# EAGLE design tricorder-featherwing-mk-1.4 (EAGLE 7.5.0)
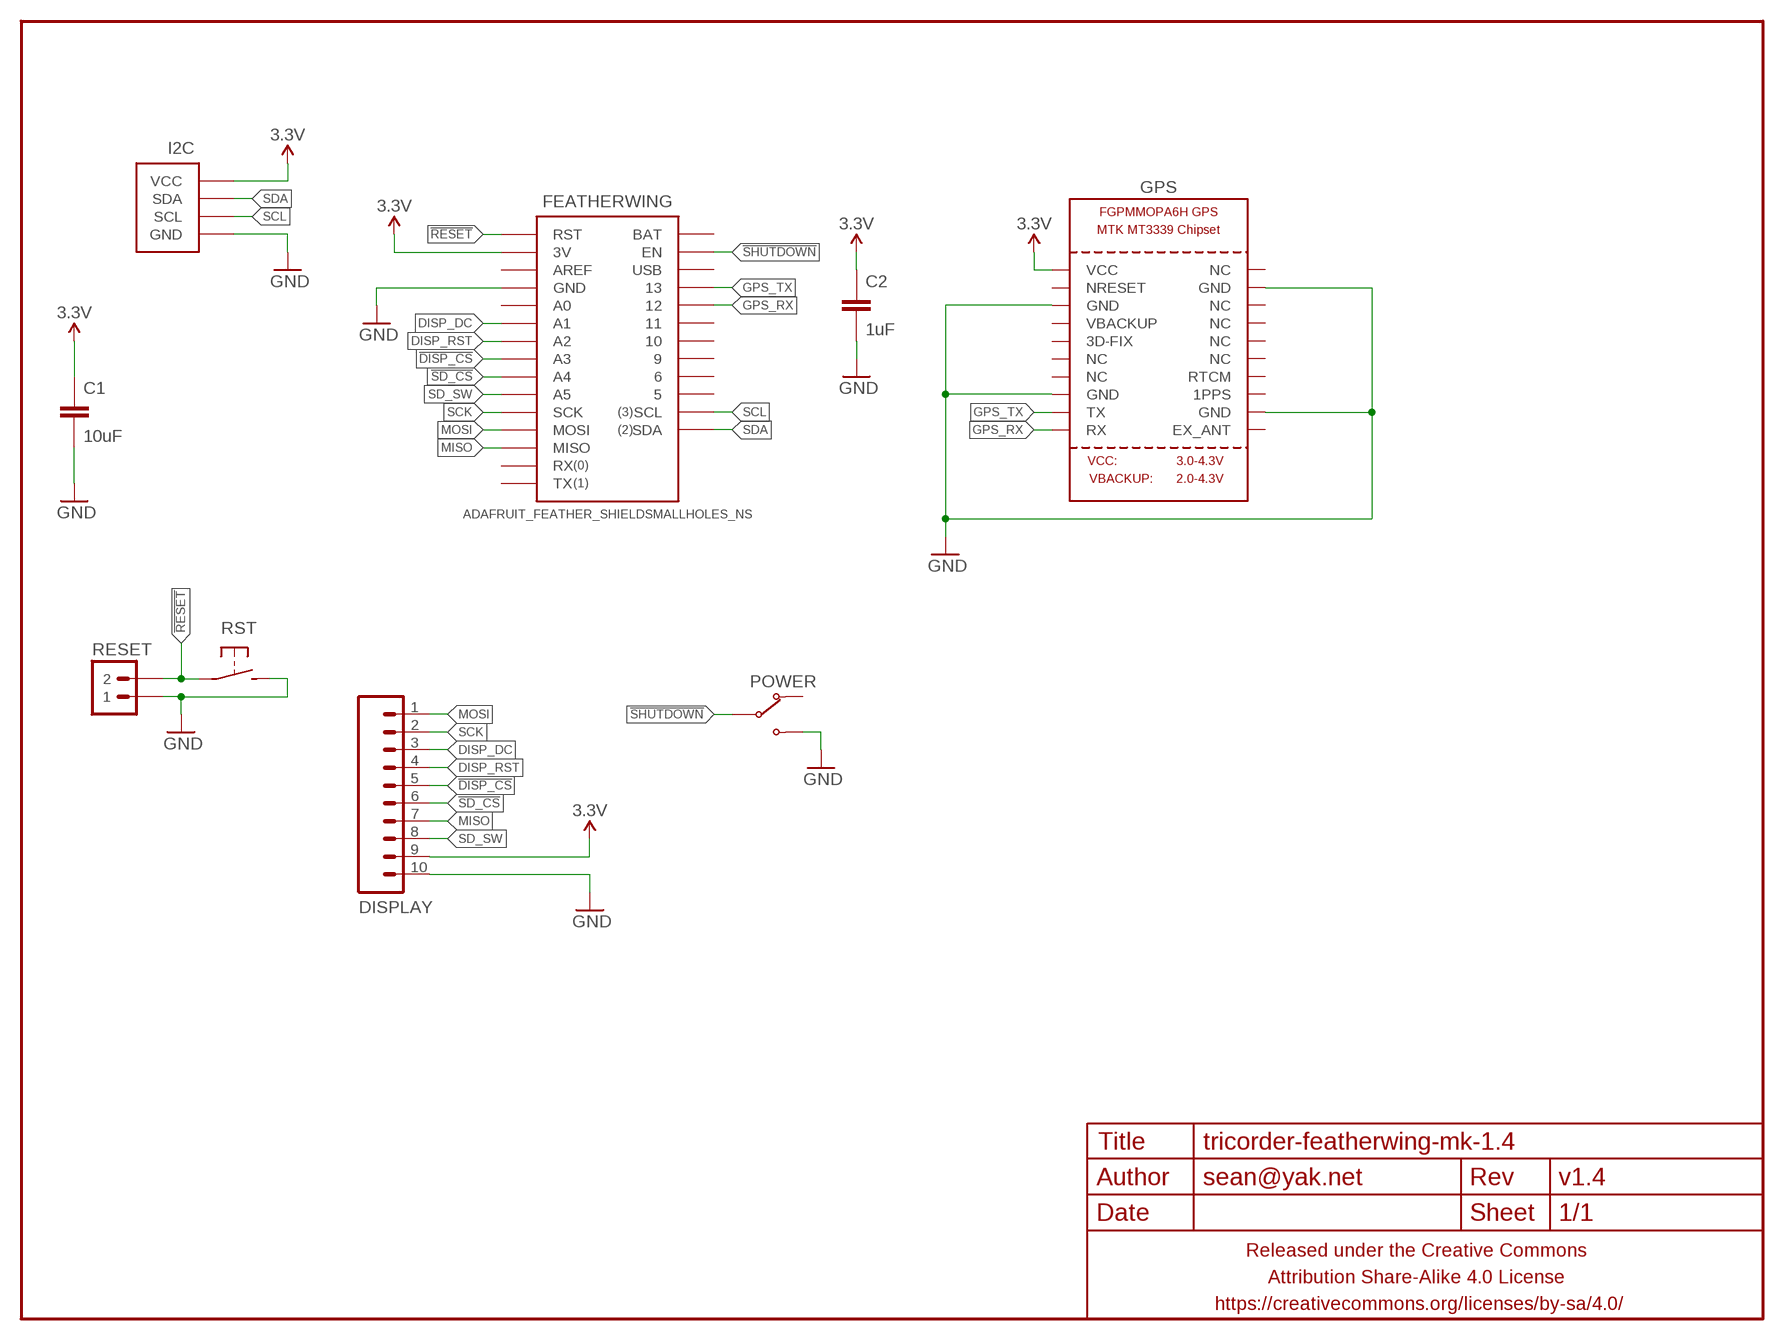
[diagram p0: schematic, sheet 1]

## Parts
C1  10uF  CAPACITOR-CERAMICC1210  [C1210]
C2  1uF  CAPACITOR-CERAMICC0603  [C0603]
DISPLAY  M10JST-10-PH-RA-PTH  [JST-10-PH-RA-PTH]
FEATHERWING  ADAFRUIT_FEATHER_SHIELDSMALLHOLES_NS  [ADAFRUIT_FEATHER_SMALLHOLES_NS]
FRAME1  FRAME-LETTERNO_PACKAGE  [DUMMY]
GPS  GPS_FGPMMOPA6H  [FGPMMOPA6H]
I2C  M04-I2CJST-4-PH-RA-CENTERED  [1X04-JST-PH-RA-PTH-I2C-CENTERED]
POWER  SWITCH-SPDTSMD-RA  [SWITCH-SPDT-SMD-RA]
RESET  M02PTH-CENTERED  [1X02-CENTER]
RST  SPST-NO-TACT3MM-PTH-SMALL-PADS  [DTS-3-SMALL-PADS]

## Nets
3.3V: C1.1 C2.1 DISPLAY.9 FEATHERWING.3V GPS.P$1(VCC) I2C.2(VCC)
!DISP_CS: DISPLAY.5 FEATHERWING.A3
!RESET: FEATHERWING.RST RESET.2 RST.1
!SD_CS: DISPLAY.6 FEATHERWING.A4
!SHUTDOWN: FEATHERWING.EN POWER.2(COM)
DISP_DC: DISPLAY.3 FEATHERWING.A1
DISP_RST: DISPLAY.4 FEATHERWING.A2
GND: C1.2 C2.2 DISPLAY.10 FEATHERWING.GND@0(GND) FEATHERWING.GND@1(GND) GPS.P$3(GND) GPS.P$8(GND) GPS.P$12(GND) GPS.P$19(GND) I2C.1(GND) POWER.1(NO) RESET.1 RST.2
GPS_RX: FEATHERWING.12 GPS.P$10(RX)
GPS_TX: FEATHERWING.13 GPS.P$9(TX)
MISO: DISPLAY.7 FEATHERWING.MISO
MOSI: DISPLAY.1 FEATHERWING.MOSI
SCK: DISPLAY.2 FEATHERWING.SCK
SCL: FEATHERWING.SCL I2C.4(SCL)
SD_SW: DISPLAY.8 FEATHERWING.A5
SDA: FEATHERWING.SDA I2C.3(SDA)
Unconnected: FEATHERWING.5 FEATHERWING.6 FEATHERWING.9 FEATHERWING.10 FEATHERWING.11 FEATHERWING.A0 FEATHERWING.AREF FEATHERWING.BAT FEATHERWING.RX FEATHERWING.TX FEATHERWING.USB GPS.P$2(NRESET) GPS.P$4(VBACKUP) GPS.P$5(3D-FIX) GPS.P$6(NC) GPS.P$7(NC) GPS.P$11(EX_ANT) GPS.P$13(1PPS) GPS.P$14(RTCM) GPS.P$15(NC) GPS.P$16(NC) GPS.P$17(NC) GPS.P$18(NC) GPS.P$20(NC) POWER.3(NC)

## Library data of the parts
C1 C2 = a_parts:CAPACITOR-CERAMIC: CAPACITOR, European symbol
DISPLAY = a_parts:M10: Header 10 Standard 10-pin 0.1" header. Use with straight break away headers (SKU : PRT-00116), right angle break away headers (PRT-00553), swiss pins (PRT-00743), machine pins (PRT-00117), and female headers (PRT-00115).
FEATHERWING = a_parts:ADAFRUIT_FEATHER_SHIELD
FRAME1 = a_parts:FRAME-LETTER: Schematic Frame Standard 8.5x11 US Letter frame; DESIGNER: sean@yak.net; VERSION: v1.4
GPS = a_parts:GPS_FGPMMOPA6H: GPS Module - MTK MT3339 Chipset, -165dBm sensitivity, 22 channels, 10Hz, auto-select external antenna options
I2C = a_parts:M04-I2C
POWER = a_parts:SWITCH-SPDT
RESET = a_parts:M02: Standard 2-pin 0.1" header. Use with - straight break away headers ( PRT-00116) - right angle break away headers (PRT-00553) - swiss pins (PRT-00743) - machine pins (PRT-00117) - female headers (PRT-00115) Molex polarized connector foot print use with: PRT-08233 with associated crimp pins and housings. 2.54_SCREWTERM for use with PRT-10571. 3.5mm Screw Terminal footprints for PRT-08084 5mm Screw Terminal footprints for use with PRT-08433
RST = a_parts:SPST-NO-TACT

## Board
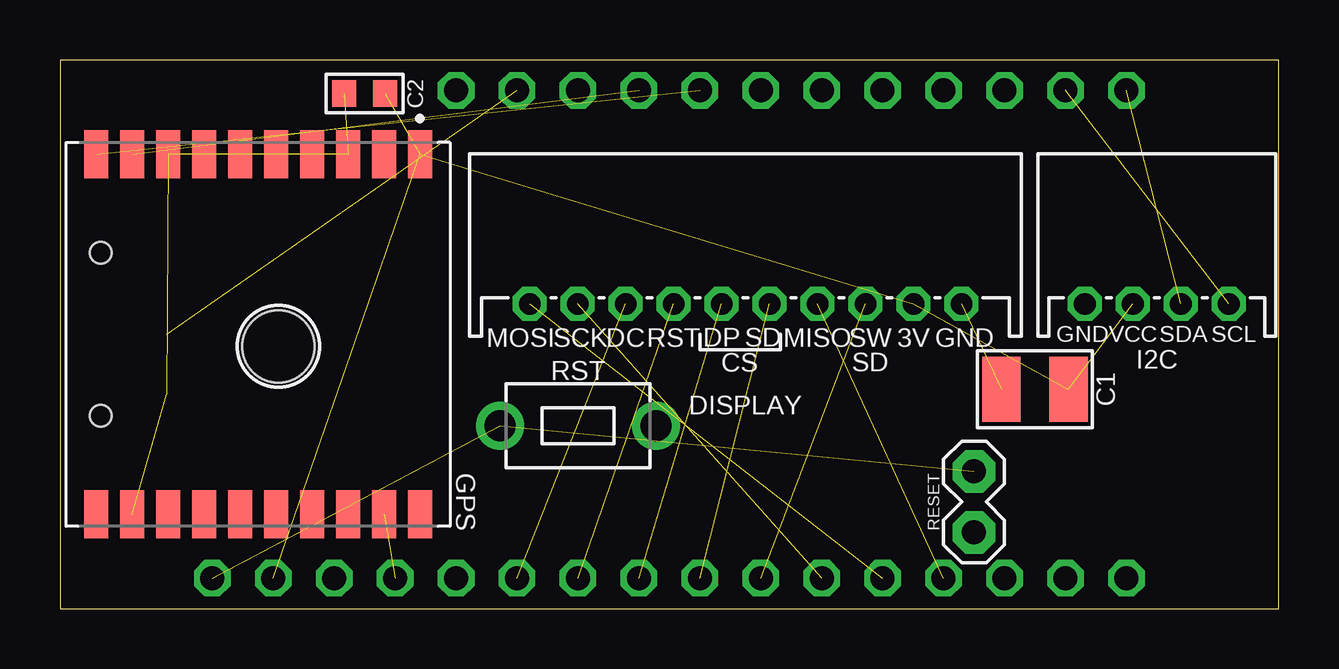
[diagram p1: board, top side]
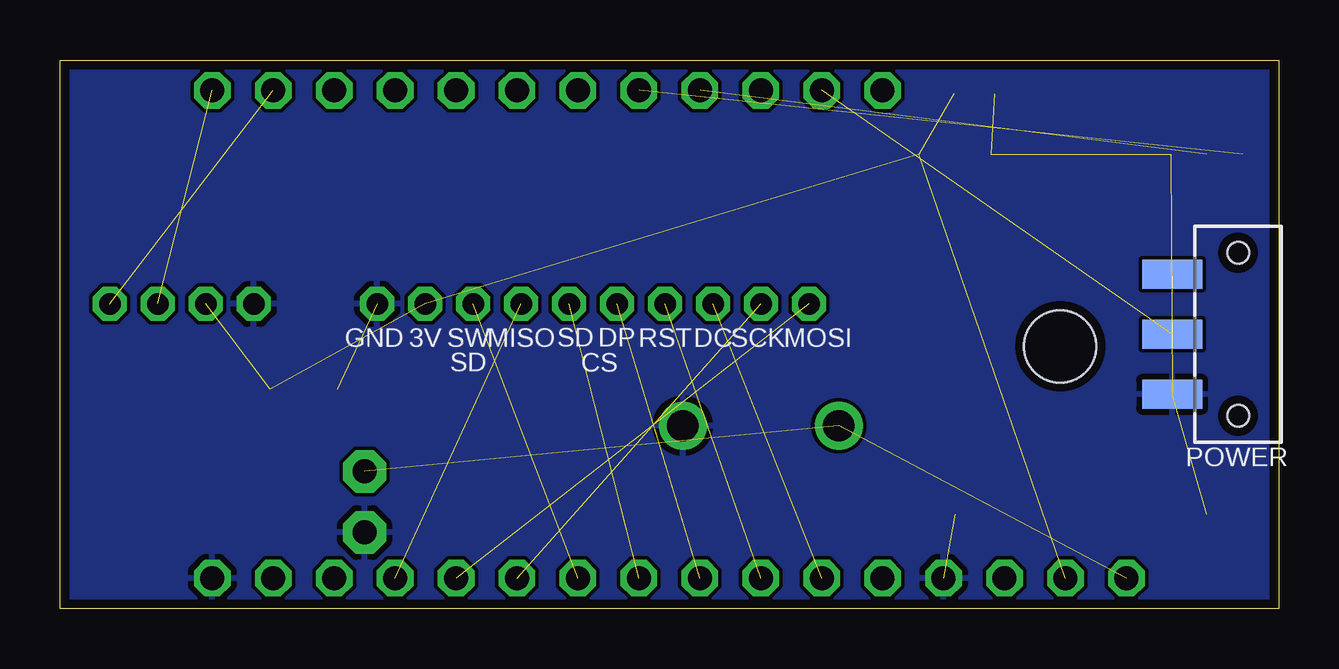
[diagram p2: board, bottom side, seen from below]

Size 50.8 x 22.86 mm. Coordinates in mm from the lower left corner, seen from the top.
Outline: 0,22.86 0,0 50.8,0 50.8,22.86 0,22.86
Copper layers (1*16): Top 0.0356mm / dielectric 1.5011mm / Bottom 0.0356mm
Design rules "LaenPCBOrder2": minimum track width 6mil, minimum drill 13mil, track to track 6mil, track to pad 6mil, pad to pad 6mil, via to via 6mil, smd to smd 6mil, copper to edge 15mil, drill to drill 6mil, minimum pad ring 7mil, minimum via ring 7mil, stop-mask expansion 3mil, vias tented up to drill 20mil, thermal gap 10mil

### Footprints (pad centres in the part's own frame; a part is rotated, then mirrored left to right if it is on the bottom)
C1210 = smd 1.6 x 2.7: 1 -1.4,0; 2 1.4,0
C0603 = smd 1 x 1.1: 1 -0.85,0; 2 0.85,0
JST-10-PH-RA-PTH = drill 0.9 pad 1.422 octagon: 1 -9,0; 2 -7,0; 3 -5,0; 4 -3,0; 5 -1,0; 6 1,0; 7 3,0; 8 5,0; 9 7,0; 10 9,0
ADAFRUIT_FEATHER_SMALLHOLES_NS = drill 1 pad 1.524 octagon: 3V -16.51,-10.16; 5 13.97,10.16; 6 11.43,10.16; 9 8.89,10.16; 10 6.35,10.16; 11 3.81,10.16; 12 1.27,10.16; 13 -1.27,10.16; A0 -8.89,-10.16; A1 -6.35,-10.16; A2 -3.81,-10.16; A3 -1.27,-10.16; A4 1.27,-10.16; A5 3.81,-10.16; AREF -13.97,-10.16; BAT -8.89,10.16; EN -6.35,10.16; GND@0 -11.43,-10.16; GND@1 19.05,-10.16; MISO 11.43,-10.16; MOSI 8.89,-10.16; RST -19.05,-10.16; RX 13.97,-10.16; SCK 6.35,-10.16; SCL 16.51,10.16; SDA 19.05,10.16; TX 16.51,-10.16; USB -3.81,10.16
FGPMMOPA6H = smd 2 x 1: P$1 -7.5,6.75; P$2 -7.5,5.25; P$3 -7.5,3.75; P$4 -7.5,2.25; P$5 -7.5,0.75; P$6 -7.5,-0.75; P$7 -7.5,-2.25; P$8 -7.5,-3.75; P$9 -7.5,-5.25; P$10 -7.5,-6.75; P$11 7.5,-6.75; P$12 7.5,-5.25; P$13 7.5,-3.75; P$14 7.5,-2.25; P$15 7.5,-0.75; P$16 7.5,0.75; P$17 7.5,2.25; P$18 7.5,3.75; P$19 7.5,5.25; P$20 7.5,6.75 | hole 3: 0.5,0.85
1X04-JST-PH-RA-PTH-I2C-CENTERED = drill 0.9 pad 1.422 octagon: 1 -3,0; 2 -1,0; 3 1,0; 4 3,0
SWITCH-SPDT-SMD-RA = smd 1.2 x 2.5: 1 -2.5,0; 2 0,0; 3 2.5,0 | hole 0.9: -3.4,-2.75; 3.4,-2.75
1X02-CENTER = drill 1 pad 1.778 octagon: 1 -1.27,0; 2 1.27,0
DTS-3-SMALL-PADS = drill 1.3 pad 2: 1 -3.25,0; 2 3.25,0

### Placement (x,y rotation side)
C1  40.64,9.14 180 top
C2  12.7,21.46 180 top
DISPLAY  28.57,12.7 0 top
FEATHERWING  25.4,11.43 0 top
FRAME1  0,0 0 top
GPS  8.26,11.43 270 top
I2C  45.72,12.7 0 top
POWER  4.45,11.43 90 bottom
RESET  38.1,4.45 90 top
RST  21.59,7.62 0 top

### Tracks (layer width: path | path; a pad name or v marks a point on that pad's centre or on a via)
3.3V  (5 unrouted)
!DISP_CS  (1 unrouted)
!RESET  (2 unrouted)
!SD_CS  (1 unrouted)
!SHUTDOWN  (1 unrouted)
DISP_DC  (1 unrouted)
DISP_RST  (1 unrouted)
GND  (6 unrouted)
  pour Bottom: 0,22.86 0,0 50.8,0 50.8,22.86
GPS_RX  (1 unrouted)
GPS_TX  (1 unrouted)
MISO  (1 unrouted)
MOSI  (1 unrouted)
SCK  (1 unrouted)
SCL  (1 unrouted)
SD_SW  (1 unrouted)
SDA  (1 unrouted)

### Text on the board
tPlace: Tricorder Featherwing | by schizobovine / <sean@yak.net> | MOSI | SCK | DC | RST | DP | SD | MISO | SW | 3V | GND | CS | SD
bPlace: MOSI | SCK | DC | RST | DP | SD | MISO | SW | 3V | GND | CS | SD